# Altium schematic sheet ESP32.SchDoc
size A; SheetNumber: 4; SheetTotal: 5
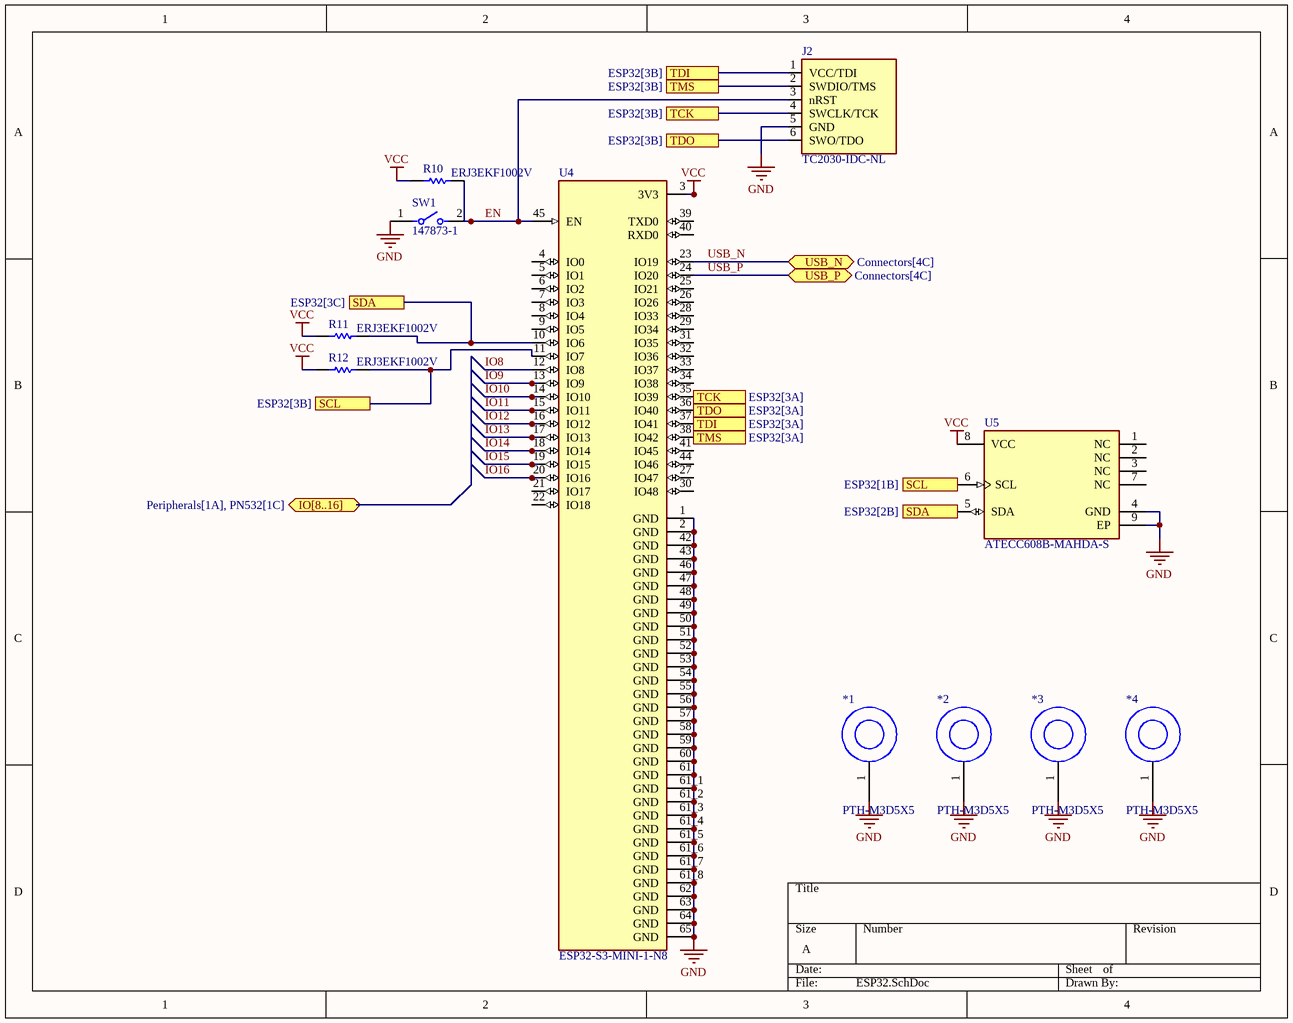
[diagram p0: ESP32.SchDoc]

## Parts
*1  PTH-M3D5X5  [PTH-M3D5X5-Footprint-1]
*2  PTH-M3D5X5  [PTH-M3D5X5-Footprint-1]
*3  PTH-M3D5X5  [PTH-M3D5X5-Footprint-1]
*4  PTH-M3D5X5  [PTH-M3D5X5-Footprint-1]
J2  TC2030-IDC-NL  [TAG_TC2030-IDC-NL]
R10  ERJ3EKF1002V  [RESC1609X55X30LL15T15]
R11  ERJ3EKF1002V  [RESC1609X55X30LL15T15]
R12  ERJ3EKF1002V  [RESC1609X55X30LL15T15]
SW1  147873-1  [FP-147873-1-MFG]
U4  ESP32-S3-MINI-1-N8  [XCVR_ESP32-S3-MINI-1-N8]
U5  ATECC608B-MAHDA-S  [FP-C04-21355-Q4B-IPC_B]

## Ports
IO[8..16] (bidir, see Peripherals[1A], PN532[1C]), SCL (see ESP32[1B]), SCL (see ESP32[3B]), SDA (see ESP32[2B]), SDA (see ESP32[3C]), TCK (see ESP32[3A]), TCK (see ESP32[3B]), TDI (see ESP32[3A]), TDI (see ESP32[3B]), TDO (see ESP32[3A]), TDO (see ESP32[3B]), TMS (see ESP32[3A]), TMS (see ESP32[3B]), USB_N (bidir, see Connectors[4C]), USB_P (bidir, see Connectors[4C])

## Nets
GND: *1.1 *2.1 *3.1 *4.1 J2.5(GND) SW1.1 U4.1(GND) U4.2(GND) U4.42(GND) U4.43(GND) U4.46(GND) U4.47(GND) U4.48(GND) U4.49(GND) U4.50(GND) U4.51(GND) U4.52(GND) U4.53(GND) U4.54(GND) U4.55(GND) U4.56(GND) U4.57(GND) U4.58(GND) U4.59(GND) U4.60(GND) U4.61(GND) U4.61_1(GND) U4.61_2(GND) U4.61_3(GND) U4.61_4(GND) U4.61_5(GND) U4.61_6(GND) U4.61_7(GND) U4.61_8(GND) U4.62(GND) U4.63(GND) U4.64(GND) U4.65(GND) U5.4(GND) U5.9(EP)
VCC: R10.2 R11.2 R12.2 U4.3(3V3) U5.8(VCC)
EN: J2.3(nRST) R10.1 SW1.2 U4.45(EN)
IO8: U4.12(IO8)
IO9: U4.13(IO9)
IO10: U4.14(IO10)
IO11: U4.15(IO11)
IO12: U4.16(IO12)
IO13: U4.17(IO13)
IO14: U4.18(IO14)
IO15: U4.19(IO15)
IO16: U4.20(IO16)
SCL: R12.1 U4.11(IO7) U5.6(SCL) ; port SCL
SDA: R11.1 U4.10(IO6) U5.5(SDA) ; port SDA
TCK: J2.4(SWCLK/TCK) U4.35(IO39) ; port TCK
TDI: J2.1(VCC/TDI) U4.37(IO41) ; port TDI
TDO: J2.6(SWO/TDO) U4.36(IO40) ; port TDO
TMS: J2.2(SWDIO/TMS) U4.38(IO42) ; port TMS
USB_N: U4.23(IO19) ; port USB_N
USB_P: U4.24(IO20) ; port USB_P

Not connected (* = marked no-connect by the designer): U4 4(IO0) 5(IO1) 6(IO2) 7(IO3) 8(IO4) 9(IO5) 21(IO17) 22(IO18) 25(IO21) 26(IO26) 27(IO47) 28(IO33) 29(IO34) 30(IO48) 31(IO35) 32(IO36) 33(IO37) 34(IO38) 39(TXD0) 40(RXD0) 41(IO45) 44(IO46); U5 1(NC) 2(NC) 3(NC) 7(NC)

## Library data of the parts
*1-*4 = CMP-010-00024-1: Plated Thru-Hole M3 D5X5; Pins: 1; Mounting Technology: TH
J2 = CMP-070-000001-2: CABLE ADAPTER 6 POS; Package: None; Price: None; Pin Count: 6; Component Type: Standard; Availability: Unavailable; MP: TC2030-IDC-NL; Design Item ID: TC2030-IDC-NL; Value: *; Source: TC2030-IDC-NL.SchLib
R10-R12 = CMP-1012-00623-3: Chip Resistor, 10 KOhm, +/- 1%, 0.1 W, -55 to 155 degC, 0603 (1608 Metric), RoHS, Tape and Reel; Manufacturer: Panasonic; Voltage Rating: 75V; Case\/Package: 0603; Power Rating: 100mW; Resistance: 10KOhm; Temperature Coefficient: 100ppm\/degreesC; Number of Pins: 2; Package Reference: 603; Depth: 0.8mm; Mount: SurfaceMount; Package Description: 2-Pin Surface Mount Device, Body 1.6 x 0.85 mm; Datasheet Version: 02/2017; Length: 1.6mm; Lead Free: LeadFree; Height: 0.45mm; Number of Terminations: 2; Max Power Dissipation: 100mW; Min Operating Temperature: -55degC; Datasheet URL: https://industrial.panasonic.com/cdbs/www-data/pdf/RDA0000/AOA0000C304.pdf; Termination: SMD/SMT; Case Code (Metric): 1608; Case Code (Imperial): 0603; Tolerance: 1%; Max Operating Temperature: 155degC; RoHSCompliant: true; Voltage Rating (DC): 75V; Radiation Hardening: No; Packaging: TapeandReel; Composition: ThickFilm; Mounting Technology: SurfaceMount; Manufacturer URL: http://www.panasonic.com/; Width: 0.031inch; REACH SVHC: NoSVHC; Contact Plating: Tin; Military Standard: Not; Package Quantity: 1
SW1 = CMP-03407-000005-1: SWITCH TACTILE SPST-NO 0.05A 24V; Manufacturer: TE Connectivity; Contact Resistance: 100mΩ; Operating Force: 180gf; Electromechanical Life: 40000Cycles; Contact Current Rating: 50mA; Throw Configuration: SPST-NO; Mouser Description: Switch Tactile OFF (ON) SPST Rectangular Button J-Bend 0.05A 24VDC 1.77N SMD T/R; Mount: Surface Mount; Height: 5.5mm; Category: Switch; RoHS: TRUE; Temperature Range High: +85°C; ComponentLink2Description: Datasheet; Temperature Range Low: -35°C; Device Class L1: Electromechanical; Device Class L2: Switches; Package: 0; Temperature: -35°C to +85°C; Device Class L3: Tactile Switches; Automotive: No; Manufacturer Part Number: 147873-1; ComponentLink2URL: https://www.te.com/commerce/DocumentDelivery/DDEController?Action=showdoc&DocId=Customer+Drawing%7F147873%7FK3%7Fpdf%7FEnglish%7FENG_CD_147873_K3.pdf%7F147873-1; Lead Free: Yes; Voltage Rating Dc: 24V; Octopart: https://octopart.com/147873-1-te+connectivity-40818451; Digikey Description: SWITCH TACTILE SPST-NO 0.05A 24V
U4 = ESP32-S3-MINI-1-N8: Bluetooth, WiFi 802.11b/g/n, Bluetooth v5.0 Transceiver Module 2.4GHz PCB Trace Surface Mount; MF: {'manufacturer': u'Espressif Systems'}; Package: None; Price: None; Value: *; MP: ESP32-S3-MINI-1-N8; Availability: Unavailable
U5 = CMP-06260-000008-1: IC AUTHENTICATION CHIP